# Altium schematic sheet TranslationDir8Chan.SchDoc: 8-Channel Directional Translation
size Letter; Engineer: Nathan Petersen; DocumentNumber: 6; Revision: v1.2; SheetNumber: 6; SheetTotal: 26
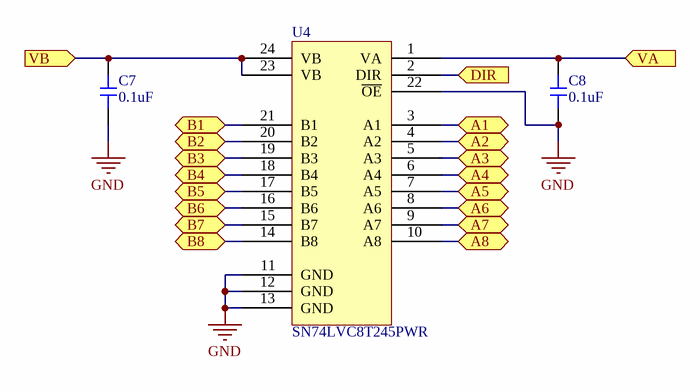
[diagram p0: TranslationDir8Chan.SchDoc]

## Parts
C7  value 0.1uF  [0603-CAP]  (hidden comment: Capacitor)
C8  value 0.1uF  [0603-CAP]  (hidden comment: Capacitor)
U4  SN74LVC8T245PWR  [TSOP65P640X120-24N]

## Ports
A1 (bidir), A2 (bidir), A3 (bidir), A4 (bidir), A5 (bidir), A6 (bidir), A7 (bidir), A8 (bidir), B1 (bidir), B2 (bidir), B3 (bidir), B4 (bidir), B5 (bidir), B6 (bidir), B7 (bidir), B8 (bidir), DIR (in), VA (in), VB (in)

## Nets
GND: C7.2 C8.2 U4.11(GND) U4.12(GND) U4.13(GND) U4.22(~{OE})
A1: U4.3(A1) ; port A1
A2: U4.4(A2) ; port A2
A3: U4.5(A3) ; port A3
A4: U4.6(A4) ; port A4
A5: U4.7(A5) ; port A5
A6: U4.8(A6) ; port A6
A7: U4.9(A7) ; port A7
A8: U4.10(A8) ; port A8
B1: U4.21(B1) ; port B1
B2: U4.20(B2) ; port B2
B3: U4.19(B3) ; port B3
B4: U4.18(B4) ; port B4
B5: U4.17(B5) ; port B5
B6: U4.16(B6) ; port B6
B7: U4.15(B7) ; port B7
B8: U4.14(B8) ; port B8
DIR: U4.2(DIR) ; port DIR
VA: C8.1 U4.1(VA) ; port VA
VB: C7.1 U4.23(VB) U4.24(VB) ; port VB

## Notes on the sheet
- Title:
- File:
- Sheet:
- of
- Revision:
- Time:
- Date:
- Engineer:

## Library data of the parts
U4 = SN74LVC8T245PWR: IC BUS TRANSCVR 8BIT 24TSSOP; Supplier 1: Digi-Key; Supplier Part Number 1: 296-18593-1-ND
C7 C8 = Capacitor: Supplier 1: Digi-Key; Supplier Part Number 1: 1276-1012-1-ND